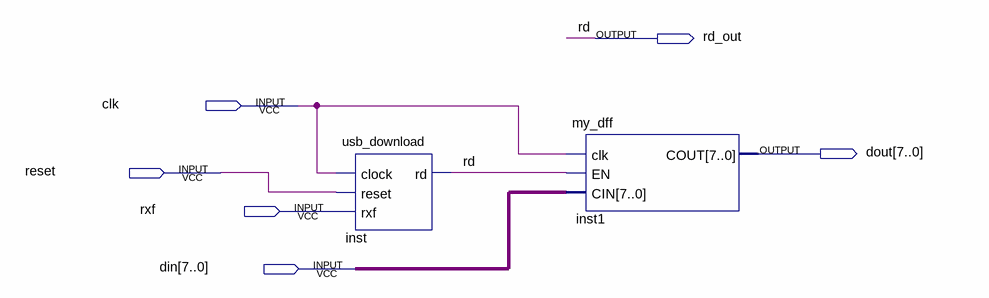
[diagram p0: schematic sheet]
// Quartus schematic usb_download_top.bdf as structural Verilog: 2 symbols, 6 pins
module usb_download_top (
  input  clk,
  input  reset,
  input  rxf,
  input  [7:0] din,
  output rd_out,
  output [7:0] dout
);

  usb_download inst (.clock(clk), .reset(reset), .rxf(rxf), .rd(rd_out));
  my_dff inst1 (.clk(clk), .EN(rd_out), .CIN(din), .COUT(dout));

  // Other names for the same wires on the sheet: rd = rd_out
endmodule
